# Altium schematic sheet DriveIGBT2020.SchDoc: Driver Xenon Flash Lamps
size A4; Date: 5/12/2017; CheckedBy: Vũ Hoàng Phương; CompanyName: PE-LAB; DrawnBy: Bùi Trung Tuyến; DocumentNumber: 2; Revision: V3.1; SheetNumber: 2; SheetTotal: 2; VersionControl_RevNumber: V3.1; Version: 3.1; ProjectName: ATTECH
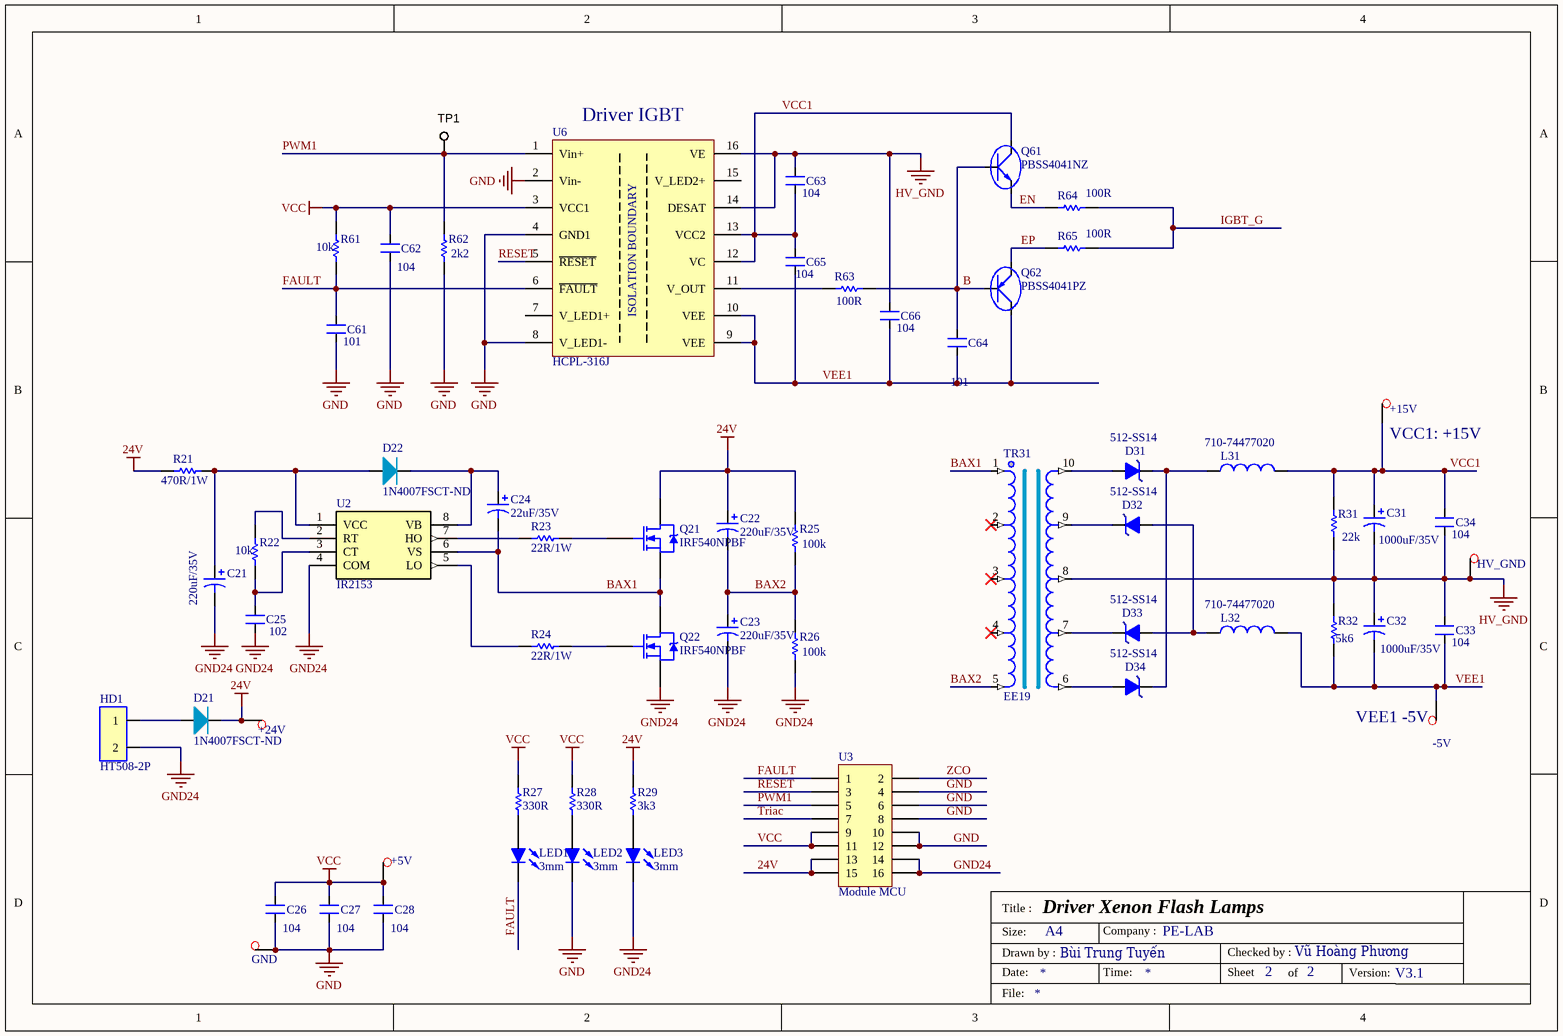
[diagram p0: DriveIGBT2020.SchDoc]

## Parts
+5V  TP  [TP2]  (value not drawn)
+15V  TP  [TP2]  (value not drawn)
+24V  TP  [TP2]  (value not drawn)
-5V  TP  [TP2]  (value not drawn)
C21  220uF/35V  [CP1.5/3.4]
C22  220uF/35V  [CP1.5/3.4]
C23  220uF/35V  [CP1.5/3.4]
C24  22uF/35V  [CP1.5/3.4]
C25  value 102  [CAPC3216N]  (hidden comment: Tụ dán SMD 1206102)
C26  value 104  [CAPC3216N]  (hidden comment: Tụ dán SMD 1206104)
C27  value 104  [CAPC3216N]  (hidden comment: Tụ dán SMD 1206104)
C28  value 104  [CAPC3216N]  (hidden comment: Tụ dán SMD 1206104)
C31  1000uF/35V  [CP1.5/3.4]
C32  1000uF/35V  [CP1.5/3.4]
C33  value 104  [CAPC3216N]  (hidden comment: Tụ dán SMD 1206104)
C34  value 104  [CAPC3216N]  (hidden comment: Tụ dán SMD 1206104)
C61  value 101  [CAPC3216N]  (hidden comment: Tụ dán SMD 1206101)
C62  value 104  [CAPC3216N]  (hidden comment: Tụ dán SMD 1206104)
C63  value 104  [CAPC3216N]  (hidden comment: Tụ dán SMD 1206104)
C64  value 101  [CAPC3216N]  (hidden comment: Tụ dán SMD 1206101)
C65  value 104  [CAPC3216N]  (hidden comment: Tụ dán SMD 1206104)
C66  value 104  [CAPC3216N]  (hidden comment: Tụ dán SMD 1206104)
D21  vl1: 1N4007FSCT-ND  [DO-41]  (hidden comment: Đi ốt cắm1N4007FSCT-ND)
D22  vl1: 1N4007FSCT-ND  [DO-41]  (hidden comment: Đi ốt cắm1N4007FSCT-ND)
D31  vl1: 512-SS14  [DO-214AC]  (hidden comment: Diode nhanh dán512-SS14)
D32  vl1: 512-SS14  [DO-214AC]  (hidden comment: Diode nhanh dán512-SS14)
D33  vl1: 512-SS14  [DO-214AC]  (hidden comment: Diode nhanh dán512-SS14)
D34  vl1: 512-SS14  [DO-214AC]  (hidden comment: Diode nhanh dán512-SS14)
GND  TP  [TP2]  (value not drawn)
HD1  HT508-2P  [HT508-2P]
HV_GND  TP  [TP2]  (value not drawn)
L31  Supplier Part Number 1: 710-74477020  [L-SMD-M-12x10]  (hidden comment: Cuộn cảm dán SMD100uH74477020)
L32  Supplier Part Number 1: 710-74477020  [L-SMD-M-12x10]  (hidden comment: Cuộn cảm dán SMD100uH74477020)
LED1  3mm  [LED 3mm]
LED2  3mm  [LED 3mm]
LED3  3mm  [LED 3mm]
Q21  IRF540NPBF  [TO-220-HEATSINK]
Q22  IRF540NPBF  [TO-220-HEATSINK]
Q61  PBSS4041NZ  [SOT223]
Q62  PBSS4041PZ  [SOT223]
R21  470R/1W  [RES-1W]
R22  value 10k  [RES-SMD-1206]  (hidden comment: Trở dán SMD 120610k)
R23  22R/1W  [RES-1W]
R24  22R/1W  [RES-1W]
R25  value 100k  [RES-SMD-1206]  (hidden comment: Trở dán SMD 1206100k)
R26  value 100k  [RES-SMD-1206]  (hidden comment: Trở dán SMD 1206100k)
R27  330R  [RES-SMD-1206]
R28  330R  [RES-SMD-1206]
R29  3k3  [RES-SMD-1206]
R31  value 22k  [RES-SMD-1206]  (hidden comment: Trở dán SMD 120622k)
R32  value 5k6  [RES-SMD-1206]  (hidden comment: Trở dán SMD 12065k6)
R61  value 10k  [RES-SMD-1206]  (hidden comment: Trở dán SMD 120610k)
R62  value 2k2  [RES-SMD-1206]  (hidden comment: Trở dán SMD 12062k2)
R63  value 100R  [RES-SMD-1206]  (hidden comment: Trở dán SMD 1206100R)
R64  value 100R  [RES-1W]  (hidden comment: Trở cắm 1W100R)
R65  value 100R  [RES-1W]  (hidden comment: Trở cắm 1W100R)
TP1  TESTPOINT_LEAD  [TP]  (value not drawn)  (no BOM)
TR31  EE19  [EE19]
U2  IR2153  [DIP8/W0.3]
U3  Module MCU  [MCU CONTROL]
U6  HCPL-316J  [SO16]

## Nets
24V: +24V.1 C22.1 D21.K Q21.2(D) R21.1 R25.2 R29.1 U3.13 U3.15
GND: C26.1 C27.1 C28.1 C61.1 C62.1 GND.1 LED2.2 R62.1 U3.4 U3.6 U3.8 U3.10 U3.12 U6.2(Vin-) U6.4(GND1) U6.8(V_LED1-)
GND24: C21.2 C23.2 C25.1 HD1.2 LED3.2 Q22.3(S) R26.1 U2.4(COM) U3.14 U3.16
HV_GND: C31.2 C32.1 C33.2 C34.1 C63.2 C66.2 HV_GND.1 R31.2 R32.1 TR31.8 U6.14(DESAT) U6.16(VE)
VCC: +5V.1 C26.2 C27.2 C28.2 C62.2 R27.1 R28.1 R61.2 U3.9 U3.11 U6.3(VCC1)
B: C64.2 Q61.1(B) Q62.1(B) R63.1
BAX1: C24.2 Q21.3(S) Q22.2(D) TR31.1 U2.6(VS)
BAX2: C22.2 C23.1 R25.1 R26.2 TR31.5
EN: Q61.3(E) R64.2
EP: Q62.3(E) R65.2
FAULT: C61.2 LED1.2 R61.1 U3.1 U6.6(~{FAULT})
IGBT_G: R64.1 R65.1
PWM1: R62.2 TP1.1 U3.5 U6.1(Vin+)
RESET: U3.3 U6.5(~{RESET})
Triac: U3.7
VCC1: +15V.1 C31.1 C34.2 C63.1 C65.2 L31.2 Q61.2(C) R31.1 U6.12(VC) U6.13(VCC2)
VEE1: -5V.1 C32.2 C33.1 C64.1 C65.1 C66.1 L32.2 Q62.2(C) R32.2 U6.9(VEE) U6.10(VEE)
ZCO: U3.2
NetC21_1: C21.1 D22.A R21.2 U2.1(VCC)
NetC24_1: C24.1 D22.K U2.8(VB)
NetC25_2: C25.2 R22.1 U2.3(CT)
NetD21_A: D21.A HD1.1
NetD31_1: D31.1(A) TR31.10
NetD31_2: D31.2(K) D34.2(K) L31.1
NetD32_1: D32.1(A) D33.1(A) L32.1
NetD32_2: D32.2(K) TR31.9
NetD33_2: D33.2(K) TR31.7
NetD34_1: D34.1(A) TR31.6
NetLED1_1: LED1.1 R27.2
NetLED2_1: LED2.1 R28.2
NetLED3_1: LED3.1 R29.2
NetQ21_1: Q21.1(G) R23.1
NetQ22_1: Q22.1(G) R24.1
NetR22_2: R22.2 U2.2(RT)
NetR23_2: R23.2 U2.7(HO)
NetR24_2: R24.2 U2.5(LO)
NetR63_2: R63.2 U6.11(V_OUT)

Not connected (* = marked no-connect by the designer): TR31 2* 3* 4*; U6 7(V_LED1+) 15(V_LED2+)

## Notes on the sheet
- (near U6) Driver IGBT
- (near +15V) VCC1: +15V
- (near -5V) VEE1 -5V
- Title :
- Size:
- Drawn by :
- Date:
- A4
- Time:
- Company :
- Sheet
- Checked by :
- of
- Version:
- File:
- (in symbol HCPL-316J) ISOLATION BOUNDARY

## Library data of the parts
C21-C23 = CP: Tụ hóa 220uF/35V cắm; cm1: Tu nhôm 450V/150uF  cắm; cm3: Tu hóa < 22uF/16>50V cắm; Value: 220uF/35V; cm2: Tụ hóa 220uF/35V cắm
C24 = CP: Tụ hóa 100uF/35V cắm; cm1: Tu nhôm 450V/150uF  cắm; cm3: Tu hóa < 22uF/16>50V cắm; cm2: Tụ hóa 22uF/35V cắm; Value: 22uF/35V
C25-C28 C33 C34 C61-C66 = CN: Tụ dán SMD 1206; cm1: Tụ lọc nhiễu X2 chân cắm; cm2: Tụ chống sét - Varistor chân cắm; cm3: Tụ kẹo chân cắm; cm5: Tụ cao áp chân cắm; cm4: Tụ dán SMD 1206
C31 C32 = CP: Tụ hóa 1000uF/35V cắm; cm1: Tu nhôm 450V/150uF  cắm; cm3: Tu hóa < 22uF/16>50V cắm; Value: 1000uF/35V; cm2: Tụ hóa 1000uF/35V cắm
D21 D22 = Diode: Manufacturer: ON Semiconductor / Fairchild; Manufacturer Part Number: 1N4007; cm2: Đi ốt dán; vl2: FR307; vl3: TVS 1.5KE300A 19A 300V; vl4: HER508 5A 1000V; Peak Non-Repetitive Surge Current: 30A; Peak Reverse Current: 5uA; Forward Voltage: 1.1V; Max Repetitive Reverse Voltage (Vrrm): 1kV; Element Configuration: Single; Forward Current: 1A; Polarity: Standard; Capacitance: 15pF; Power Dissipation: 3W; cm1: Đi ốt cắm; Supplier 1: Digi-Key; Stock 1: 0; Pricing 1: 1=0.18, 10=0.168, 100=0.0912, 500=0.05614, 1000=0.03827 (USD); Mount: Through Hole; Number of Pins: 2; Weight: 0.245g; Contact Plating: Matte,Tin; Min Operating Temperature: -65°C; Max Operating Temperature: 175°C; Packaging: Tape and Reel; Max Forward Surge Current (Ifsm): 30A; Max Surge Current: 30A; Package Quantity: 1000; Voltage Rating (DC): 1kV; Current Rating: 1A; Output Current: 1A; Average Rectified Current: 1A; Max Reverse Voltage (DC): 1kV; Reverse Voltage: 1kV; Diameter: 2.72mm; Length: 5.2mm; Height: 5.2mm; Width: 2.72mm; Radiation Hardening: No; REACH SVHC: No SVHC; Lead Free: Lead Free
D31-D34 = Diode: Diode nhanh dán; Manufacturer: ON Semiconductor / Fairchild; Value: SS14; cm1: Diode nhanh cắm; cm3: Diode zenner; Peak Reverse Current: 200uA; Forward Current: 1A; Max Repetitive Reverse Voltage (Vrrm): 40V; Element Configuration: Single; Forward Voltage: 500mV; Peak Non-Repetitive Surge Current: 40A; Polarity: Standard; Number of Elements: 1; Max Power Dissipation: 1.1W; cm2: Diode nhanh dán; Supplier 1: Mouser; Manufacturer Part Number: SS14; Stock 1: 456962; Pricing 1: 1=0.42, 10=0.294, 50=0.294, 100=0.135, 1000=0.104, 10000=0.081 (USD); Mount: Surface Mount; Case/Package: SMA; Number of Pins: 2; Weight: 0.003739oz; Number of Terminals: 2; Min Operating Temperature: -65°C; Max Operating Temperature: 125°C; Packaging: Tape and Reel; Package Quantity: 7500; Current Rating: 1A; Voltage Rating (DC): 40V; Max Forward Surge Current (Ifsm): 40A; Termination: SMD/SMT; Output Current: 1A; Average Rectified Current: 1A; Current: 1A; Voltage: 40V; Max Reverse Voltage (DC): 40V; Power Dissipation: 1.1W; Length: 4.75mm; Height: 2.2mm; Width: 2.95mm; Radiation Hardening: No; Lead Free: Lead Free; REACH SVHC: No SVHC
HD1 = HEADER2: 300V 10A; Value: HT508-2P; cm: 300V 10A
L31 L32 = Inductor: Cuộn cảm dán SMD; Manufacturer: Wurth Electronics; Value: 100uH; Core Material: Ferrite; Tolerance: 20%; Self Resonant Frequency: 5.2MHz; Shielding: Shielded; Max DC Current: 2.2A; DC Resistance (DCR): 220mR; Saturation Current: 2.4A; Test Frequency: 1kHz; cm2: Cuộn cảm dán SMD; Supplier 1: Mouser; pn: 74477020; Stock 1: 2215; Pricing 1: 1=2.25, 10=2.1, 50=1.95, 100=1.78, 1000=1.25, 10000=1.25 (USD); Mount: Surface Mount; Case/Package: Nonstandard; Number of Pins: 2; Weight: 0.04lb; Min Operating Temperature: -40°C; Max Operating Temperature: 125°C; Package Quantity: 500; Packaging: Tape and Reel; Inductance Tolerance: 20%; Inductance: 100uh; RMS Current (Irms): 2.2A; Termination: SMD/SMT; Current Rating: 2.2A; Series Resistance: 220mR; Composition: Wirewound; Resistance: 220mR; Length: 12mm; Height: 8mm; Width: 12mm; Depth: 12mm; Height - Seated (Max): 0.315inch; Lead Pitch: 7mm; REACH SVHC: Unknown
LED1 = LED 3mm: Led đỏ chân cắm; cm: Led đỏ; Value: 3mm
LED2 LED3 = LED 3mm: Led xanh chân cắm; cm: Led đỏ; Value: 3mm
Q21 Q22 = IRF540N: HEXFET Power MOSFET; Manufacturer: International Rectifier; Continuous Drain Current (ID): 33A; Gate to Source Voltage (Vgs): 20V; Power Dissipation: 130W; Rise Time: 35ns; Number of Elements: 1; Drain to Source Voltage (Vdss): 100V; Drain to Source Resistance: 44mR; Current Rating: 27A; Input Capacitance: 1.96nF; Turn-Off Delay Time: 39ns; Element Configuration: Single; Turn-On Delay Time: 11ns; Nominal Vgs: 4V; Recovery Time: 170ns; cm: HEXFET Power MOSFET; Value: IRF540N; Supplier 1: Arrow; Supplier Part Number 1: IRF540NPBF; Manufacturer Part Number: IRF540NPBF; Stock 1: 450; Pricing 1: 1=0.6745, 10=0.6227, 100=0.5214, 500=0.4542, 1000=0.4012 (USD); Mount: Through Hole; Case/Package: TO-220AB; Number of Pins: 3; Min Operating Temperature: -55°C; Max Operating Temperature: 175°C; Packaging: Rail/Tube; Drain to Source Breakdown Voltage: 100V; Voltage Rating (DC): 100V; Max Power Dissipation: 130W; Package Quantity: 50; Rds On Max: 44mR; Fall Time: 35ns; On-State Resistance: 44MR; Dual Supply Voltage: 100V; Termination: Through Hole; Threshold Voltage: 4V; Length: 10.54mm; Height: 8.77mm; Width: 4.69mm; Lead Pitch: 2.54mm; Radiation Hardening: No; Lead Free: Lead Free; REACH SVHC: No SVHC
Q61 = PBSS4041NZ: TRANS NPN 60V 7A SOT223; Manufacturer: NXP Semiconductors; Manufacturer Part Number: PBSS4041NZ,115; Max Power Dissipation: 2.6W; Transition Frequency: 105MHz; Emitter Base Voltage (VEBO): 5V; Element Configuration: Single; hFE Min: 300; Number of Elements: 1; Value: PBSS4041NZ; Supplier 1: Mouser; Supplier Part Number 1: 771-PBSS4041NZ115; Stock 1: 0; Pricing 1: 1=0.83, 10=0.682, 50=0.682, 100=0.44, 1000=0.352, 10000=0.287 (USD); Mount: Surface Mount; Case/Package: SC; Number of Pins: 4; Min Operating Temperature: -55°C; Max Operating Temperature: 150°C; Collector Emitter Voltage (VCEO): 60V; Max Collector Current: 7A; Polarity: NPN; Collector Emitter Breakdown Voltage: 60V; Collector Base Voltage (VCBO): 60V; Packaging: Tape and Reel; Package Quantity: 1; Max Breakdown Voltage: 60V; Power Dissipation: 2.6W; Gain Bandwidth Product: 105MHz; Radiation Hardening: No; Lead Free: Lead Free
Q62 = PBSS4041PZ: TRANS PNP 60V 5.7A SOT223; Manufacturer: NXP Semiconductors; Manufacturer Part Number: PBSS4041PZ,115; Max Power Dissipation: 2.6W; Transition Frequency: 110MHz; Emitter Base Voltage (VEBO): -5V; Element Configuration: Single; hFE Min: 200; Number of Elements: 1; Value: PBSS4041PZ; Supplier 1: Mouser; Supplier Part Number 1: 771-PBSS4041PZ115; Stock 1: 274; Pricing 1: 1=0.75, 10=0.62, 50=0.62, 100=0.4, 1000=0.32, 10000=0.261 (USD); Mount: Surface Mount; Case/Package: SC; Number of Pins: 4; Min Operating Temperature: -55°C; Max Operating Temperature: 150°C; Collector Emitter Voltage (VCEO): 60V; Max Collector Current: 5.7A; Packaging: Tape and Reel; Collector Emitter Breakdown Voltage: 60V; Polarity: PNP; Collector Base Voltage (VCBO): 60V; Package Quantity: 1; Max Breakdown Voltage: 60V; Power Dissipation: 2.6W; Frequency: 110MHz; Gain Bandwidth Product: 110MHz; Radiation Hardening: No
R21 R23 R24 R64 R65 = Resistor: Trở cắm 1W; cm1: Trở dán SMD 1206; cm3: Trở cắm 2W; cm4: Trở cắm 5W; cm5: Trở cắm 1/4W; cm6: NTC; cm2: Trở cắm 1W
  R21: Value: 470R/1W
  R23 R24: Value: 22R/1W
R22 R25-R29 R31 R32 R61-R63 = Resistor: Trở dán SMD 1206; cm2: Trở cắm 1W; cm3: Trở cắm 2W; cm4: Trở cắm 5W; cm5: Trở cắm 1/4W; cm6: NTC; cm1: Trở dán SMD 1206
  R27 R28: Value: 330R
  R29: Value: 3k3
TP1 = TESTPOINT_LEAD: TEST POINT
TR31 = Tranformer: Value: EE19
U2 = IR2153: IC, MOSFET/IGBT DRIVER HALF BRIDGE; Manufacturer: International Rectifier; Manufacturer Part Number: IR2153PBF; cm: Self-Oscillating Half-Bridge Driver; Frequency: 106kHz; Min Supply Voltage: 10V; Max Supply Voltage: 16.8V; Rise Time: 150ns; Number of Outputs: 2; Fall Time: 100ns; Power Dissipation: 1W; Nominal Supply Current: 5mA; Output Voltage: 20V; Max Output Current: 400mA; Value: IR2153; Supplier 1: Mouser; Supplier Part Number 1: 942-IR2153PBF; Stock 1: 8993; Pricing 1: 1=2.08, 10=1.76, 50=1.76, 100=1.41, 1000=1.03, 10000=0.88 (USD); Mount: Surface Mount,Through Hole; Case/Package: SOIC; Number of Pins: 8; Min Operating Temperature: -40°C; Max Operating Temperature: 125°C; Packaging: Rail/Tube; Package Quantity: 50; Number of Drivers: 2; Max Power Dissipation: 1W; Max Supply Current: 5mA; Max Frequency: 106kHz; Output Current: 400mA; Type: Integrated Circuit (IC); Turn-Off Delay Time: 100ns; Turn-On Delay Time: 150ns; Length: 10.92mm; Height: 4.94mm; Width: 7.11mm; Radiation Hardening: No; REACH SVHC: No SVHC; Lead Free: Lead Free
U6 = HCPL-316J: BROADCOM LIMITED         HCPL-316J-500E             OPTOCOUPLER, GATE DRIVE, 1-CH, 3.75KV; cm1: OPTOISO 5KV 2CH GATE DRIVER 16SO; Number of Channels: 2; Propagation Delay: 500ns; Isolation Voltage: 5kV; Max Output Current: 2.5A; Pulse Width Distortion (PWD): 300ns; High Level Output Current: 2A; Approvals: CSA,EN,IEC,UR; Value: HCPL-316J; Supplier 1: Digi-Key; Supplier Part Number 1: 516-1777-1-ND; Manufacturer: Broadcom; Manufacturer Part Number: HCPL-316J-500E; Stock 1: 5204; Pricing 1: 1=7.39, 10=6.161, 25=5.1748, 100=4.4356, 250=3.94272 (USD); Mount: Surface Mount; Case/Package: SOIC; Number of Pins: 16; Min Operating Temperature: -40°C; Max Operating Temperature: 100°C; Packaging: Tape and Reel; Low Level Output Current: 2A; REACH SVHC: No SVHC
U3 = Module MCU: Value: Module MCU